# Altium schematic sheet Fan_Interfaces.SchDoc
size A; SheetNumber: 15; SheetTotal: 15
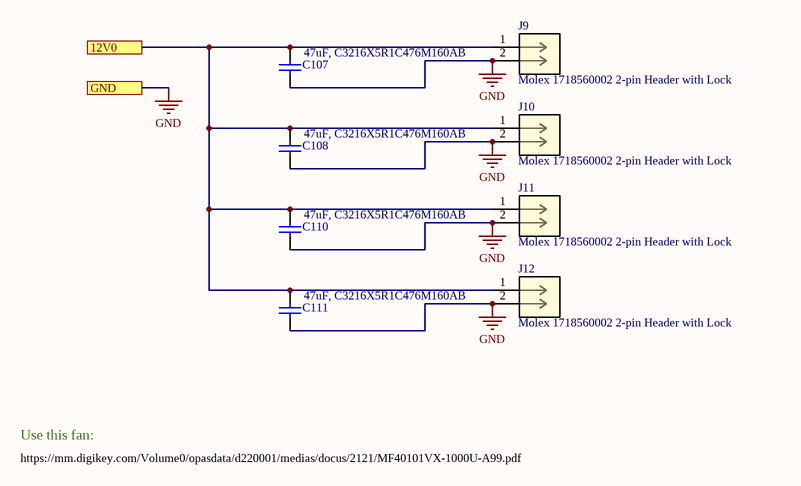
[diagram p0: Fan_Interfaces.SchDoc]

## Parts
C107  47uF, C3216X5R1C476M160AB  [SMD-1206]
C108  47uF, C3216X5R1C476M160AB  [SMD-1206]
C110  47uF, C3216X5R1C476M160AB  [SMD-1206]
C111  47uF, C3216X5R1C476M160AB  [SMD-1206]
J9  Molex 1718560002 2-pin Header with Lock  [Molex 1718560002 2-pin header with lock]
J10  Molex 1718560002 2-pin Header with Lock  [Molex 1718560002 2-pin header with lock]
J11  Molex 1718560002 2-pin Header with Lock  [Molex 1718560002 2-pin header with lock]
J12  Molex 1718560002 2-pin Header with Lock  [Molex 1718560002 2-pin header with lock]

## Ports
12V0 (see Main[2C], Microzed_Interfaces[3B]), GND (see Main[3C], 3V7_to_3V3_LDO[1B], 5V5_to_5V0_LDO[1C], Buck_TPSM82913_1V8[3C], Buck_TPSM82913_3V7[3C], Buck_TPSM82913_5V0[3C], Buck_TPSM82913_5V5[2C], Clocking_and_LO[2A], IQ_Demod[1C], IQ_Mod[1B], LMX2820[4D], Microzed_Interfaces[1A], Power_Supply[6B], Voltage_Conv_Bidirectional[1B])

## Nets
GND: C107.1 C108.1 C110.1 C111.1 J9.2 J10.2 J11.2 J12.2 ; port GND
12V0: C107.2 C108.2 C110.2 C111.2 J9.1 J10.1 J11.1 J12.1 ; port 12V0

## Notes on the sheet
- https://mm.digikey.com/Volume0/opasdata/d220001/medias/docus/2121/MF40101VX-1000U-A99.pdf
- Use this fan:

## Library data of the parts
C107 C108 C110 C111 = CAP1206: Ceramic Capacitor 1206 Imperial
J9-J12 = Molex 1718560002 2-pin Header with Lock: No Description Available; Mfr_Name: Molex Connector Corporation; RefDes: RefDes; Type: Type